# EAGLE schematic Charging Dock 1.4 (EAGLE 7.3.0)
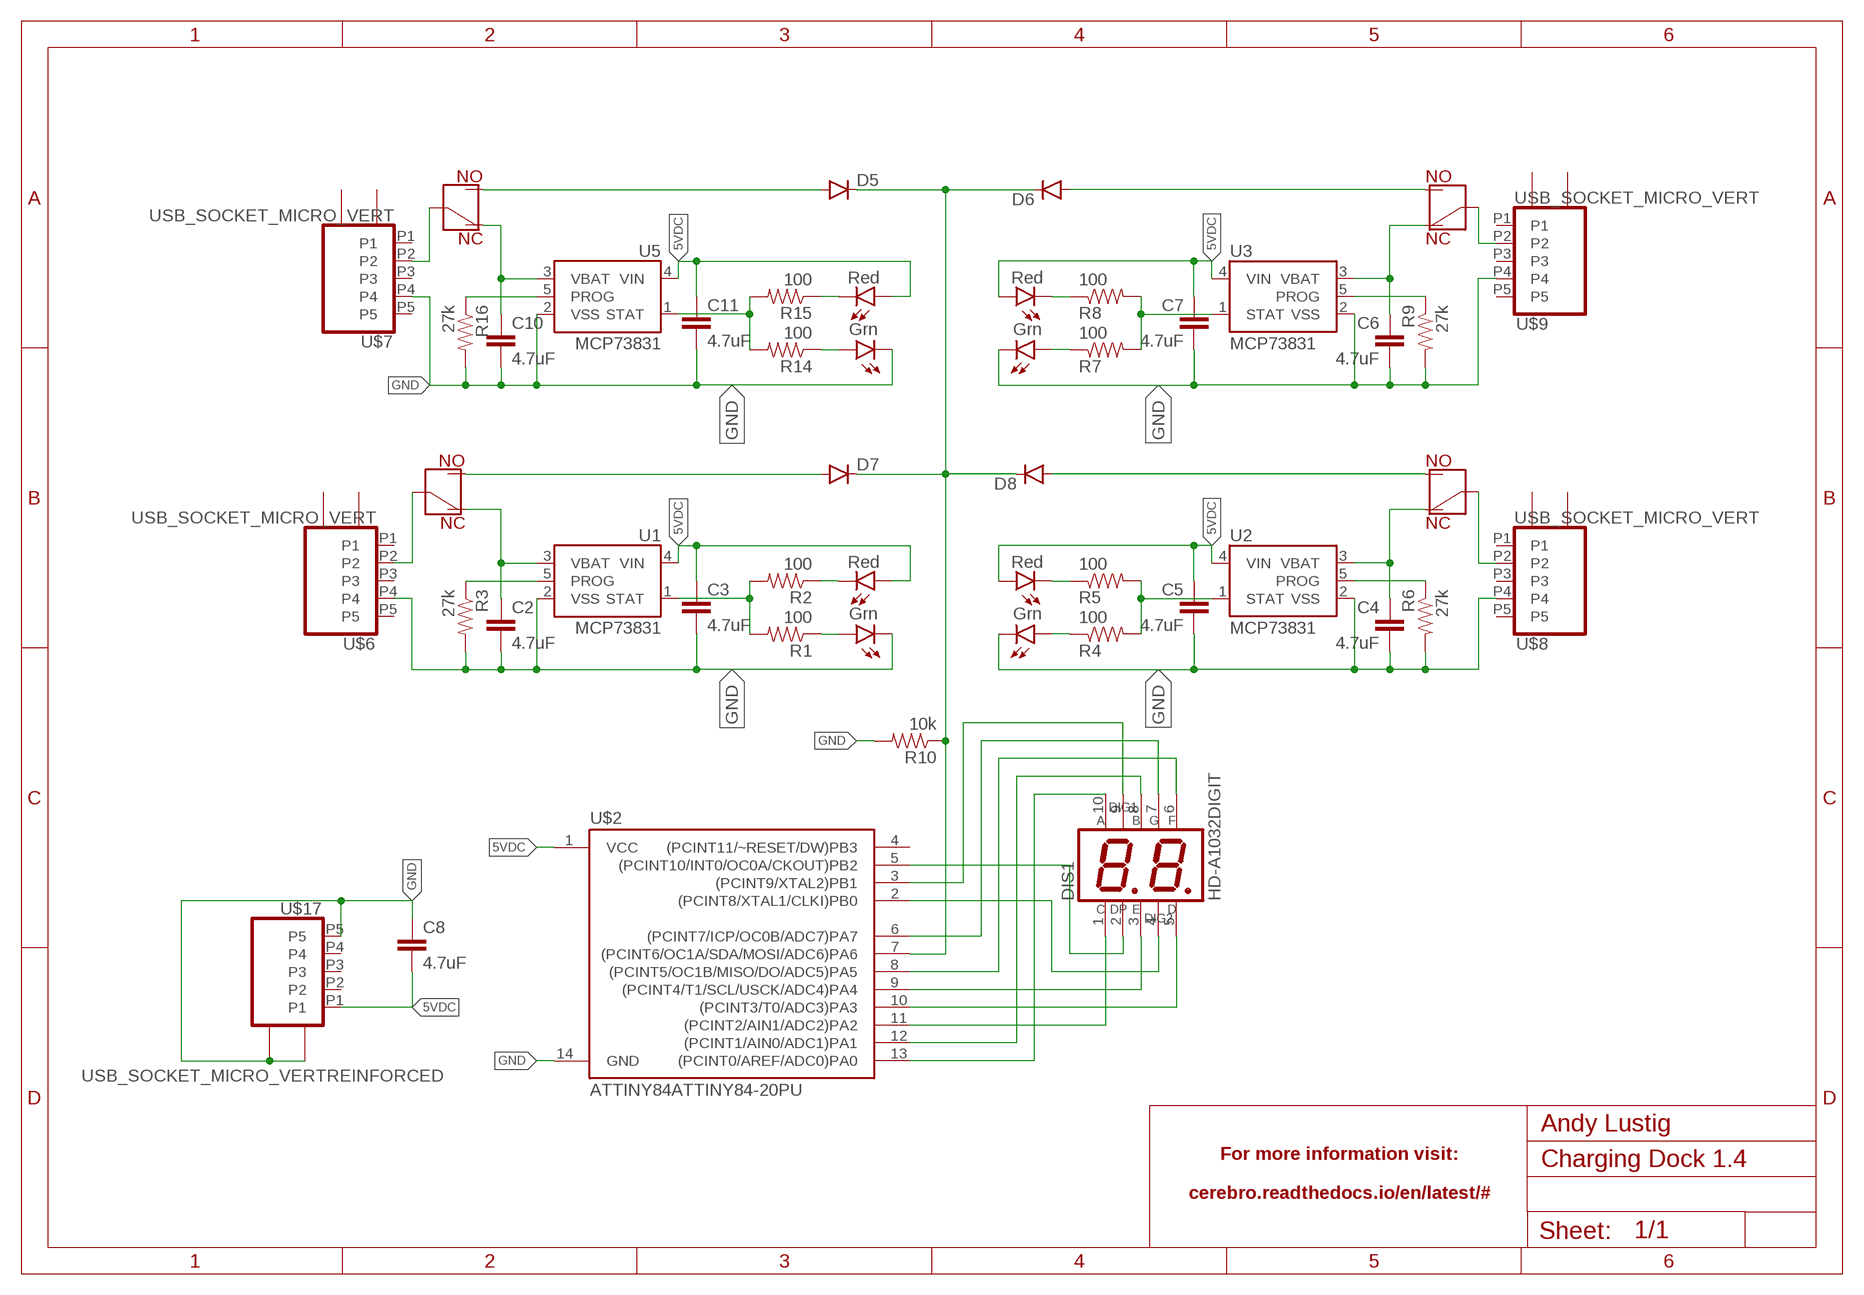
[diagram p0: schematic, sheet 1]

## Parts
C2  4.7uF  1.0UF-25V-+80/-20(0805)  [0805]
C3  4.7uF  1.0UF-25V-+80/-20(0805)  [0805]
C4  4.7uF  1.0UF-25V-+80/-20(0805)  [0805]
C5  4.7uF  1.0UF-25V-+80/-20(0805)  [0805]
C6  4.7uF  1.0UF-25V-+80/-20(0805)  [0805]
C7  4.7uF  1.0UF-25V-+80/-20(0805)  [0805]
C8  4.7uF  1.0UF-25V-+80/-20(0805)  [0805]
C10  4.7uF  1.0UF-25V-+80/-20(0805)  [0805]
C11  4.7uF  1.0UF-25V-+80/-20(0805)  [0805]
D5  DIODESOD123  [SOD-123]
D6  DIODESOD123  [SOD-123]
D7  DIODESOD123  [SOD-123]
D8  DIODESOD123  [SOD-123]
DIS1  HD-A1032DIGIT  [HDSP-A]
R1  100  RESISTOR0805-RES  [0805]
R2  100  RESISTOR0805-RES  [0805]
R3  27k  RESISTOR0805-RES  [0805]
R4  100  RESISTOR0805-RES  [0805]
R5  100  RESISTOR0805-RES  [0805]
R6  27k  RESISTOR0805-RES  [0805]
R7  100  RESISTOR0805-RES  [0805]
R8  100  RESISTOR0805-RES  [0805]
R9  27k  RESISTOR0805-RES  [0805]
R10  10k  RESISTOR0805-RES  [0805]
R14  100  RESISTOR0805-RES  [0805]
R15  100  RESISTOR0805-RES  [0805]
R16  27k  RESISTOR0805-RES  [0805]
U1  MCP73831  [SOT23-5]
U2  MCP73831  [SOT23-5]
U3  MCP73831  [SOT23-5]
U5  MCP73831  [SOT23-5]
U$1  SPDT_MOMENTARY  [SPDT_MOMENTRAY]
U$2  ATTINY84ATTINY84-20PU  [DIL14]
U$3  SPDT_MOMENTARY  [SPDT_MOMENTRAY]
U$4  SPDT_MOMENTARY  [SPDT_MOMENTRAY]
U$5  SPDT_MOMENTARY  [SPDT_MOMENTRAY]
U$6  USB_SOCKET_MICRO_VERT  [USB_VERT_MICRO_SMD]
U$7  USB_SOCKET_MICRO_VERT  [USB_VERT_MICRO_SMD]
U$8  USB_SOCKET_MICRO_VERT  [USB_VERT_MICRO_SMD]
U$9  USB_SOCKET_MICRO_VERT  [USB_VERT_MICRO_SMD]
U$11  LED_DUAL  [LED_DUAL]
U$12  LED_DUAL  [LED_DUAL]
U$13  LED_DUAL  [LED_DUAL]
U$14  LED_DUAL  [LED_DUAL]
U$17  USB_SOCKET_MICRO_VERTREINFORCED  [USB_HORZ_REINFORCED_MICRO]

## Nets
5VDC: C3.1 C5.1 C7.1 C8.2 C11.1 U1.4(VIN) U2.4(VIN) U3.4(VIN) U5.4(VIN) U$2.1(VCC) U$11.RA U$12.RA U$13.RA U$14.RA U$17.P1
GND: C2.2 C3.2 C4.2 C5.2 C6.2 C7.2 C8.1 C10.2 C11.2 R3.2 R6.2 R9.2 R10.2 R16.2 U1.2(VSS) U2.2(VSS) U3.2(VSS) U5.2(VSS) U$2.14(GND) U$6.P4 U$7.P4 U$8.P4 U$9.P4 U$11.GC U$12.GC U$13.GC U$14.GC U$17.G1 U$17.G2 U$17.P5 U$17.P$1 U$17.P$2
N$1: DIS1.10(A) U$2.13((PCINT0/AREF/ADC0)PA0)
N$2: R3.1 U1.5(PROG)
N$3: C2.1 U1.3(VBAT) U$5.1(NC)
N$4: R1.2 R2.2 U1.1(STAT)
N$5: R1.1 U$12.GA
N$6: R2.1 U$12.RC
N$7: R6.1 U2.5(PROG)
N$8: C4.1 U2.3(VBAT) U$4.1(NC)
N$9: R4.2 R5.2 U2.1(STAT)
N$10: R4.1 U$13.GA
N$11: U$5.COMMON U$6.P2
N$12: R5.1 U$13.RC
N$13: R9.1 U3.5(PROG)
N$14: C6.1 U3.3(VBAT)
N$15: R7.2 R8.2 U3.1(STAT)
N$16: R7.1 U$14.GA
N$17: U$3.COMMON U$9.P2
N$18: R8.1 U$14.RC
N$22: DIS1.8(B) U$2.12((PCINT1/AIN0/ADC1)PA1)
N$23: DIS1.1(C) U$2.11((PCINT2/AIN1/ADC2)PA2)
N$24: DIS1.5(D) U$2.10((PCINT3/T0/ADC3)PA3)
N$25: DIS1.3(E) U$2.9((PCINT4/T1/SCL/USCK/ADC4)PA4)
N$26: DIS1.6(F) U$2.8((PCINT5/OC1B/MISO/DO/ADC5)PA5)
N$27: DIS1.7(G) U$2.6((PCINT7/ICP/OC0B/ADC7)PA7)
N$28: DIS1.9(CC1) U$2.3((PCINT9/XTAL2)PB1)
N$29: U$3.1(NC)
N$30: DIS1.2(DP) U$2.5((PCINT10/INT0/OC0A/CKOUT)PB2)
N$31: DIS1.4(CC2) U$2.2((PCINT8/XTAL1/CLKI)PB0)
N$32: D6.A U$3.2(NO)
N$33: U$4.COMMON U$8.P2
N$34: D8.A U$4.2(NO)
N$35: U$1.COMMON U$7.P2
N$36: D5.A U$1.2(NO)
N$37: D5.C D6.C D7.C D8.C R10.1 U$2.7((PCINT6/OC1A/SDA/MOSI/ADC6)PA6)
N$39: D7.A U$5.2(NO)
N$40: R16.1 U5.5(PROG)
N$41: C10.1 U5.3(VBAT) U$1.1(NC)
N$42: R14.2 R15.2 U5.1(STAT)
N$43: R14.1 U$11.GA
N$44: R15.1 U$11.RC
Unconnected: U$2.4((PCINT11/~RESET/DW)PB3) U$6.P1 U$6.P3 U$6.P5 U$6.P$1 U$6.P$2 U$6.P$3 U$7.P1 U$7.P3 U$7.P5 U$7.P$1 U$7.P$2 U$7.P$3 U$8.P1 U$8.P3 U$8.P5 U$8.P$1 U$8.P$2 U$8.P$3 U$9.P1 U$9.P3 U$9.P5 U$9.P$1 U$9.P$2 U$9.P$3 U$17.P2 U$17.P3 U$17.P4

## Library data of the parts
C2-C8 C10 C11 = SparkFun-Capacitors:1.0UF-25V-+80/-20(0805): CAP-11625; PROD_ID: CAP-11625; VALUE: 1.0uF
D5-D8 = SparkFun-DiscreteSemi:DIODE: Diode These are standard reverse protection diodes and small signal diodes. SMA package can handle up to about 1A. SOD-323 can handle about 200mA. What the SOD-323 package when ordering, there are some mfgs out there that are 5-pin packages.
DIS1 = Andy-library:HD-A103: LED DISPLAY 1-character 7 segment, decimal point right; OC_FARNELL: unknown; OC_NEWARK: unknown
R1-R10 R14-R16 = Andy-library:RESISTOR: Resistor Basic schematic elements and footprints for 0603, 1206, and PTH resistors.
U1-U3 U5 = SparkFun-PowerIC:MCP73831: Miniature single cell, fully integrated Li-Ion, Li-polymer charge management controller http://ww1.microchip.com/downloads/en/DeviceDoc/21984a.pdf IC-09995; PROD_ID: IC-09995
U$1 U$3-U$5 = Andy-library:SPDT_MOMENTARY: Digikey P/N CKN1595-ND
U$2 = SparkFun-DigitalIC:ATTINY84: Atmel 14-pin 2/4/8kB flash uC
U$6-U$9 U$17 = Andy-library:USB_SOCKET_MICRO_VERT: horizontal socket. Digikey 609-4616-1-ND
U$11-U$14 = Andy-library:LED_DUAL

## Net classes
0 default: width 0.254 mm, clearance 0.254 mm
1 power: width 0.61 mm, drill 0.61 mm, clearance 0.254 mm
2 gnd: width 0.305 mm, drill 0.559 mm, clearance 0.254 mm
3 usbvcc: width 0.508 mm, drill 0.61 mm, clearance 0.254 mm
4 aref: width 0.406 mm, drill 0.61 mm, clearance 0.254 mm